# Altium schematic sheet Battery Voltage Monitor.SchDoc: Battery Monitor
size A4; DocumentNumber: 3; SheetNumber: 3; SheetTotal: 3
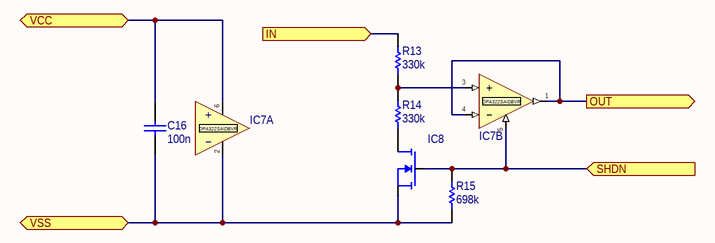
[diagram p0: Battery Voltage Monitor.SchDoc]

## Parts
C16  value 100n  [C0603]  (hidden comment: CC0603KRX7R9BB104)
IC7  OPA322SAIDBVR  [SOT-23-6]  (value not drawn)  (parts A,B of 2)
IC8  PMZ600UNEL  [SOT-883]  (value not drawn)
R13  value 330k  [R0603]  (hidden comment: ERA-3AEB334V)
R14  value 330k  [R0603]  (hidden comment: ERA-3AEB334V)
R15  value 698k  [R0603]  (hidden comment: ERJ-3EKF6983V)

## Ports
IN (in), OUT (out), SHDN (in), VCC, VSS

## Nets
IN: R13.2 ; port IN
OUT: IC7.1(Out) IC7.4(−) ; port OUT
SHDN: IC7.5(~{SHDN}) IC8.1(G) R15.2 ; port SHDN
VCC: C16.2 IC7.6(+) ; port VCC
VSS: C16.1 IC7.2(-) IC8.2(S) R15.1 ; port VSS
NetIC7_3: IC7.3(+) R13.1 R14.2
NetIC8_3: IC8.3(D) R14.1

## Notes on the sheet
- Title
- Size:
- Date:
- A4
- Time:
- Revision:
- Sheet
- of
- Drawn by:
- Approved by:
- File:

## Library data of the parts
C16 = CC0603KRX7R9BB104: Cap, 100n, 0603, X7R, 50V; Manufacturer: Yageo; Rated Voltage: 50V; Dielectric: X7R; Temperature: 125°C; ComponentLink2URL: P:/UPY-GPHC_X7R_6.3V-to-50V_18.pdf; ComponentLink2Description: Part Series Datasheet; OC_FEPA: 1031198; Supplier 1: Digi-Key; Supplier Part Number 1: 311-1344-1-ND; Supplier Part Number 2: -; Supplier 2: Farnell; Supplier 3: Mouser; Supplier Part Number 3: 603-CC603KRX7R9BB104; MPN: CC0603KRX7R9BB104
IC7 = OPA322SAIDBVR: Op-Amp, SOT-32, 1.7-5.5V, Rail-to-rail, Nanopower; Manufacturer: Texas Instruments; ComponentLink1URL: P:/opa322.pdf; ComponentLink1Description: Datasheet; OC_FEPA: *; MPN: OPA322SAIDBVR; Supplier Part Number 2: -; Supplier 2: Farnell; Supplier 1: Digi-Key; Supplier Part Number 1: 296-40465-1-ND; Supplier 3: Mouser; Supplier Part Number 3: 595-OPA322SAIDBVR
IC8 = PMZ600UNEL: MOSFET, SOT-883, n-channel, 20V, 0.6A, low leakage current; Manufacturer: Nexperia; ComponentLink1URL: P:/PMZ600UNEL.pdf; ComponentLink1Description: Datasheet; OC_FEPA: *; Supplier 1: Digi-Key; Supplier Part Number 1: 1727-2598-1-ND; Supplier 2: Farnell; Supplier Part Number 2: 2673079; Supplier 3: Mouser; Supplier Part Number 3: 771-PMZ600UNELYL; MPN: PMZ600UNEL
R13 R14 = ERA-3AEB334V: Res, 330k, 0603, 0.1%, 25ppm, 75V, 100mW; Manufacturer: Panasonic Electronic Components; Rated Voltage: 75V; Tolerance: 0.1%; Type: Thin Film; Rated Power: 100mW; OC_FEPA: *; ComponentLink2URL: P:/AOA0000C307.pdf; ComponentLink2Description: Part Series Datasheet; Temperature Coefficient: 25ppm; MPN: ERA-3AEB334V; Supplier 1: Digi-Key; Supplier Part Number 1: P330KDBCT-ND; Supplier 2: Farnell; Supplier Part Number 2: 1577639; Supplier 3: Mouser; Supplier Part Number 3: 667-ERA-3AEB334V
R15 = ERJ-3EKF6983V: Res, 698k, 0603, 1%, 75V, 100mW; Manufacturer: Panasonic Electronic Components; Temperature Coefficient: 100ppm; Rated Voltage: 75V; Tolerance: 1%; Type: Thick Film; Rated Power: 100mW; OC_FEPA: *; ComponentLink2URL: P:/AOA0000C304.pdf; ComponentLink2Description: Part Series Datasheet; MPN: ERJ-3EKF6983V; Supplier 1: Digi-Key; Supplier Part Number 1: P698KHCT-ND; Supplier 2: Farnell; Supplier Part Number 2: 2303307; Supplier 3: Mouser; Supplier Part Number 3: 667-ERJ-3EKF6983V